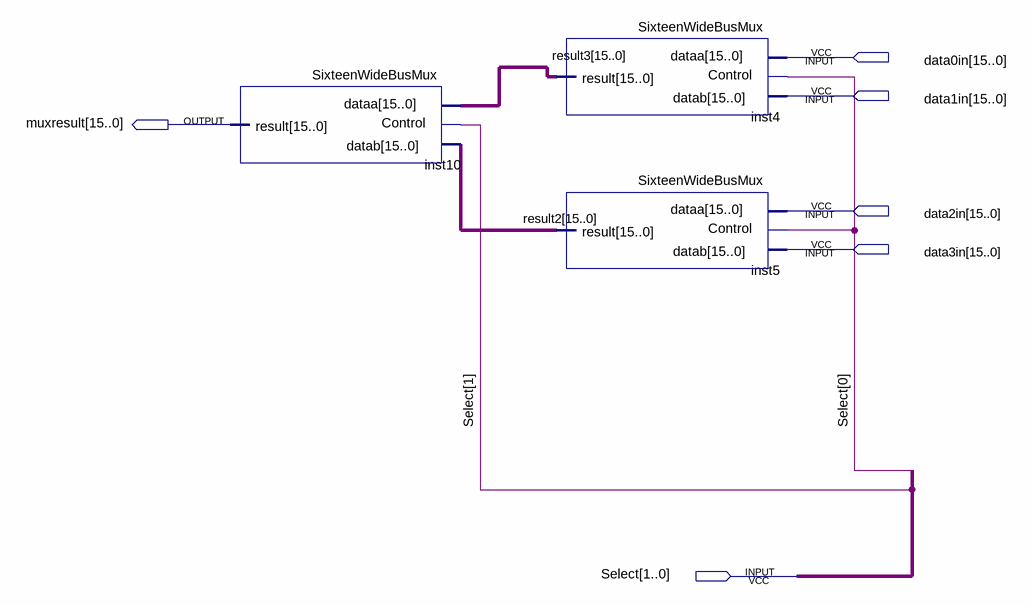
[diagram p0: schematic sheet]
// Quartus schematic 16Wide4To1BusMux.bdf as structural Verilog: 3 symbols, 6 pins
module \16Wide4To1BusMux  (
  input  [15:0] data0in,
  input  [15:0] data1in,
  input  [15:0] data2in,
  input  [15:0] data3in,
  input  [1:0] Select,
  output [15:0] muxresult
);

  wire [15:0] result2, result3;

  SixteenWideBusMux inst10 (.Control(Select[1]), .dataa(result3), .datab(result2), .result(muxresult));
  SixteenWideBusMux inst4 (.Control(Select[0]), .dataa(data0in), .datab(data1in), .result(result3));
  SixteenWideBusMux inst5 (.Control(Select[0]), .dataa(data2in), .datab(data3in), .result(result2));
endmodule
